# EAGLE design blinky_tag_tht_ver1 (EAGLE 9.5.2)
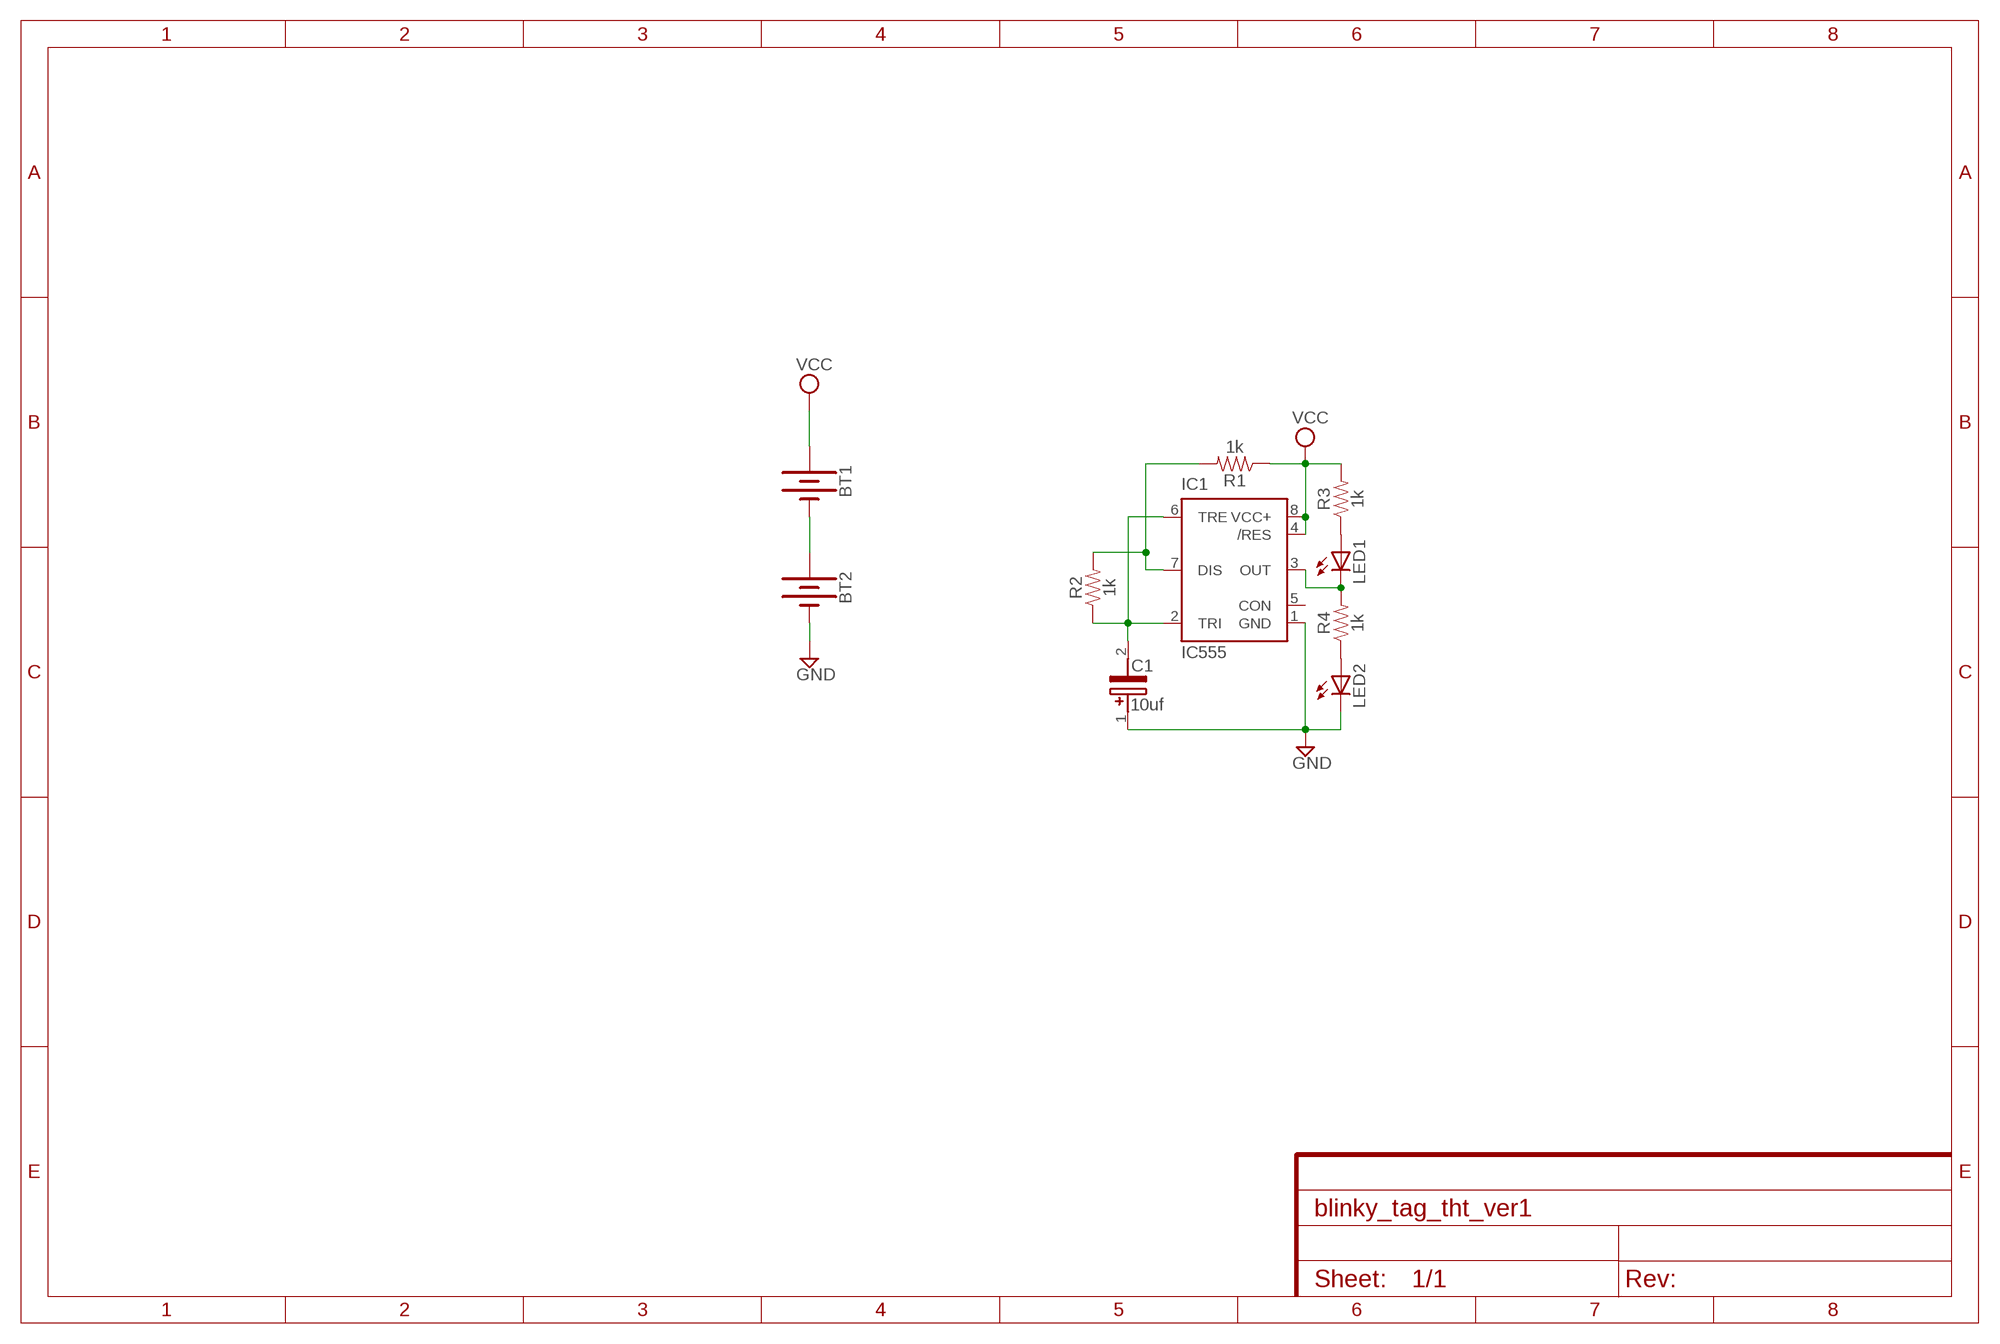
[diagram p0: schematic, sheet 1]

## Parts
BT1  BATTERY-12MM_SMD  [BATTCON_12MM]
BT2  BATTERY-12MM_SMD  [BATTCON_12MM]
C1  10uf  860020472003  [CAPPRD200W52D500H1250]
IC1  IC555  555KIT  [DIP08-KIT]
LED1  LED5MM  [LED5MM]
LED2  LED5MM  [LED5MM]
R1  1k  1KOHM-HORIZ-1/4W-5%  [AXIAL-0.3]
R2  1k  1KOHM-HORIZ-1/4W-5%  [AXIAL-0.3]
R3  1k  1KOHM-HORIZ-1/4W-5%  [AXIAL-0.3]
R4  1k  1KOHM-HORIZ-1/4W-5%  [AXIAL-0.3]

## Nets
GND: BT2.GND(-) C1.1(+) IC1.1(GND) LED2.K(C)
N$1: BT1.GND(-) BT2.PWR@1(+)
N$4: IC1.7(DIS) R1.P$2 R2.P$2
N$5: C1.2(-) IC1.2(TRI) IC1.6(TRE) R2.P$1
N$6: LED2.A R4.P$1
N$7: LED1.A R3.P$1
N$8: IC1.3(OUT) LED1.K(C) R4.P$2
VCC: BT1.PWR@1(+) IC1.4(/RES) IC1.8(VCC+) R1.P$1 R3.P$2
Unconnected: IC1.5(CON)

## Library data of the parts
BT1 BT2 = SparkFun-Batteries:BATTERY: Battery - Single Cell A variety of battery chemistries, sizes, and footprints. Device List: 20MM_PTH - Coin Cell Battery Holder - 20mm (PTH) <https://www.sparkfun.com/products/783> 6.8MM_PTH - Coin Cell Battery Holder - 6.8MM(SMD) <https://www.digikey.com/product-detail/en/seiko-instruments/MS621FE-FL11E/728-1057-ND/1889208?WT.srch=1&gclid=CNOQ5a6LzdQCFZS2wAodXCkE0g> 12MM_SMD - Coin Cell Battery Holder - 12mm (SMD) <https://www.sparkfun.com/products/10592> 12MM_PTH - Coin Cell Battery Holder - 12mm (PTH) <https://www.sparkfun.com/products/7948> 20MM_SMD - 20mm Coin Cell Battery Holder (SMD) (2 legs) Used on the Big Time Watch Kit <https://www.sparkfun.com/products/11734> 20MM_SMD_4LEGS - Coin Cell Battery Holder - 20mm (SMD) <https://www.sparkfun.com/products/11892> 20MM_SMD_4LEGS_OVERPASTE - Coin Cell Battery Holder - 20mm (SMD) <https://www.sparkfun.com/products/11892> (Over-paste on the legs) 24.5MM_PTH - Coin Cell Battery Holder - 24.5mm (PTH) <https://www.sparkfun.com/products/8863> 9V - 9V Battery Holder - PC Mount Used on the SparkFun SparkPunk Sound Kit <https://www.sparkfun.com/products/11177> and SparkFun SparkPunk Sequencer Kit <https://www.sparkfun.com/products/12707> 18650 - Battery Holder - 18650 (PTH) <https://www.sparkfun.com/products/13113> AA - Battery Holder - 1xAA (PTH) <https://www.sparkfun.com/products/7949> AAA - Battery Holder - 1xAAA (PTH) <https://www.sparkfun.com/products/12718> AA_KIT - Battery Holder - 1xAA (PTH) <https://www.sparkfun.com/products/7949> Special kit package - pads only have exposed copper on one side of the board. AAA_KIT - Battery Holder - 1xAAA (PTH) <https://www.sparkfun.com/products/12718> Special kit package - pads only have exposed copper on one side of the board.; OC_FARNELL: unknown; PROD_ID: BATT-08044; SF_SKU: PRT-10592
C1 = SamacSys_Parts:860020472003: Wurth Elektronik 10uF 25 V dc Aluminium Electrolytic Capacitor, WCAP-ATG5 Series 2000h 5 (Dia.) x 11mm Source: Datasheet <https://katalog.we-online.com/pbs/datasheet/860020472003.pdf>; DESCRIPTION: Wurth Elektronik 10uF 25 V dc Aluminium Electrolytic Capacitor, WCAP-ATG5 Series 2000h 5 (Dia.) x 11mm; HEIGHT: 12.5mm; MANUFACTURER_NAME: Wurth Elektronik; MANUFACTURER_PART_NUMBER: 860020472003; MF: RUBYCON; MOUSER_PART_NUMBER: 710-860020472003; MOUSER_PRICE-STOCK: https://www.mouser.com/Search/Refine.aspx?Keyword=710-860020472003; MPN: 100YXF10MEFC6.3X11; OC_FARNELL: 1144640; RS_PART_NUMBER: 8396508P; RS_PRICE-STOCK: http://uk.rs-online.com/web/p/products/8396508P
IC1 = SparkFun-IC-Special-Function:555: General purpose bipolar Timer Datasheet <http://www.sparkfun.com/datasheets/Components/General/ne555.pdf> SparkFun Products SparkFun SparkPunk Sequencer Kit <https://www.sparkfun.com/products/12707> (KIT-12707) Storefront Component: 555 Timer <https://www.sparkfun.com/products/9273> (COM-09273) Two parts valid for production: VFP: IC-11930 (M7555 PTH) VFP: IC-09173 (555 PTH) - Preferred; MF: ON SEMICONDUCTOR; MPN: LM555CN; OC_FARNELL: 2454497; PROD_ID: IC-09173; PROD_ID_ALT: IC-11930; VALUE: 555
LED1 LED2 = adafruit:LED: LED OSRAM: - CHIPLED LG R971, LG N971, LY N971, LG Q971, LY Q971, LO R971, LY R971 LH N974, LH R974 LS Q976, LO Q976, LY Q976 LO Q996 - Hyper CHIPLED LW Q18S LB Q993, LB Q99A, LB R99A - SideLED LS A670, LO A670, LY A670, LG A670, LP A670 LB A673, LV A673, LT A673, LW A673 LH A674 LY A675 LS A676, LA A676, LO A676, LY A676, LW A676 LS A679, LY A679, LG A679 - Hyper Micro SIDELED® LS Y876, LA Y876, LO Y876, LY Y876 LT Y87S - SmartLED LW L88C, LW L88S LB L89C, LB L89S, LG L890 LS L89K, LO L89K, LY L89K LS L896, LA L896, LO L896, LY L896 - TOPLED LS T670, LO T670, LY T670, LG T670, LP T670 LSG T670, LSP T670, LSY T670, LOP T670, LYG T670 LG T671, LOG T671, LSG T671 LB T673, LV T673, LT T673, LW T673 LH T674 LS T676, LA T676, LO T676, LY T676, LB T676, LH T676, LSB T676, LW T676 LB T67C, LV T67C, LT T67C, LS T67K, LO T67K, LY T67K, LW E67C LS E67B, LA E67B, LO E67B, LY E67B, LB E67C, LV E67C, LT E67C LW T67C LS T679, LY T679, LG T679 LS T770, LO T770, LY T770, LG T770, LP T770 LB T773, LV T773, LT T773, LW T773 LH T774 LS E675, LA E675, LY E675, LS T675 LS T776, LA T776, LO T776, LY T776, LB T776 LHGB T686 LT T68C, LB T68C - Hyper Mini TOPLED® LB M676 - Mini TOPLED Santana® LG M470 LS M47K, LO M47K, LY M47K Source: http://www.osram.convergy.de/; OC_FARNELL: unknown
R1-R4 = SparkFun-Resistors:1KOHM: 1kΩ resistor A resistor is a passive two-terminal electrical component that implements electrical resistance as a circuit element. Resistors act to reduce current flow, and, at the same time, act to lower voltage levels within circuits. - Wikipedia; OC_FARNELL: unknown; PROD_ID: RES-08380

## Board
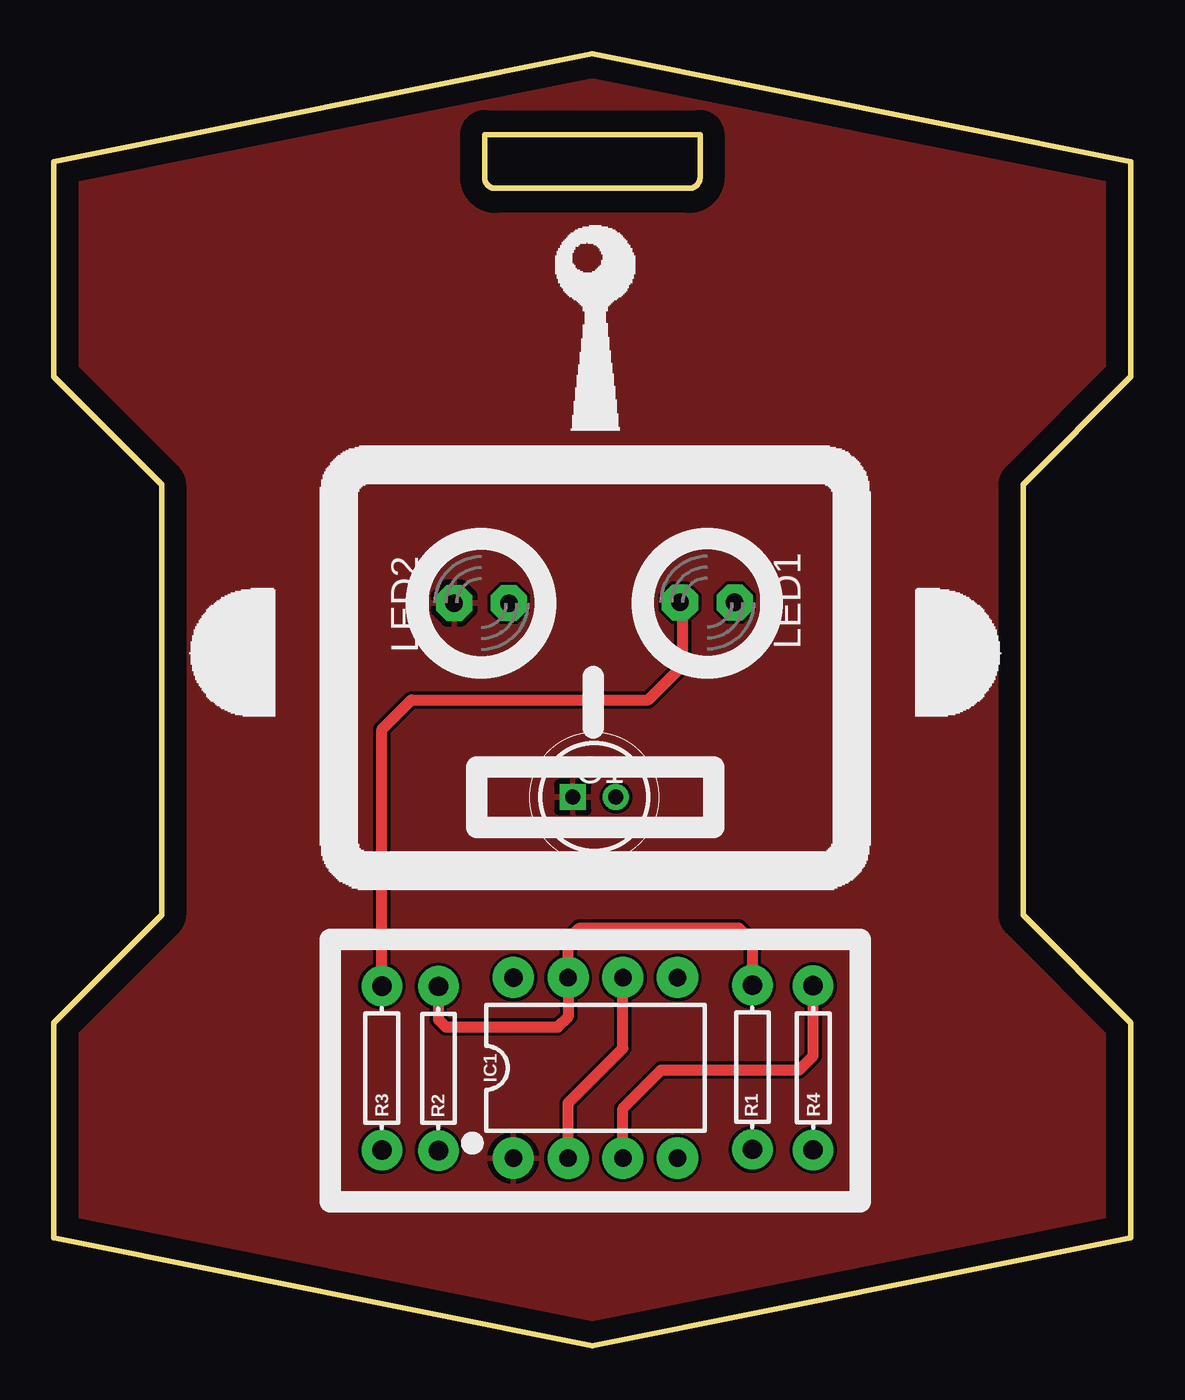
[diagram p1: board, top side]
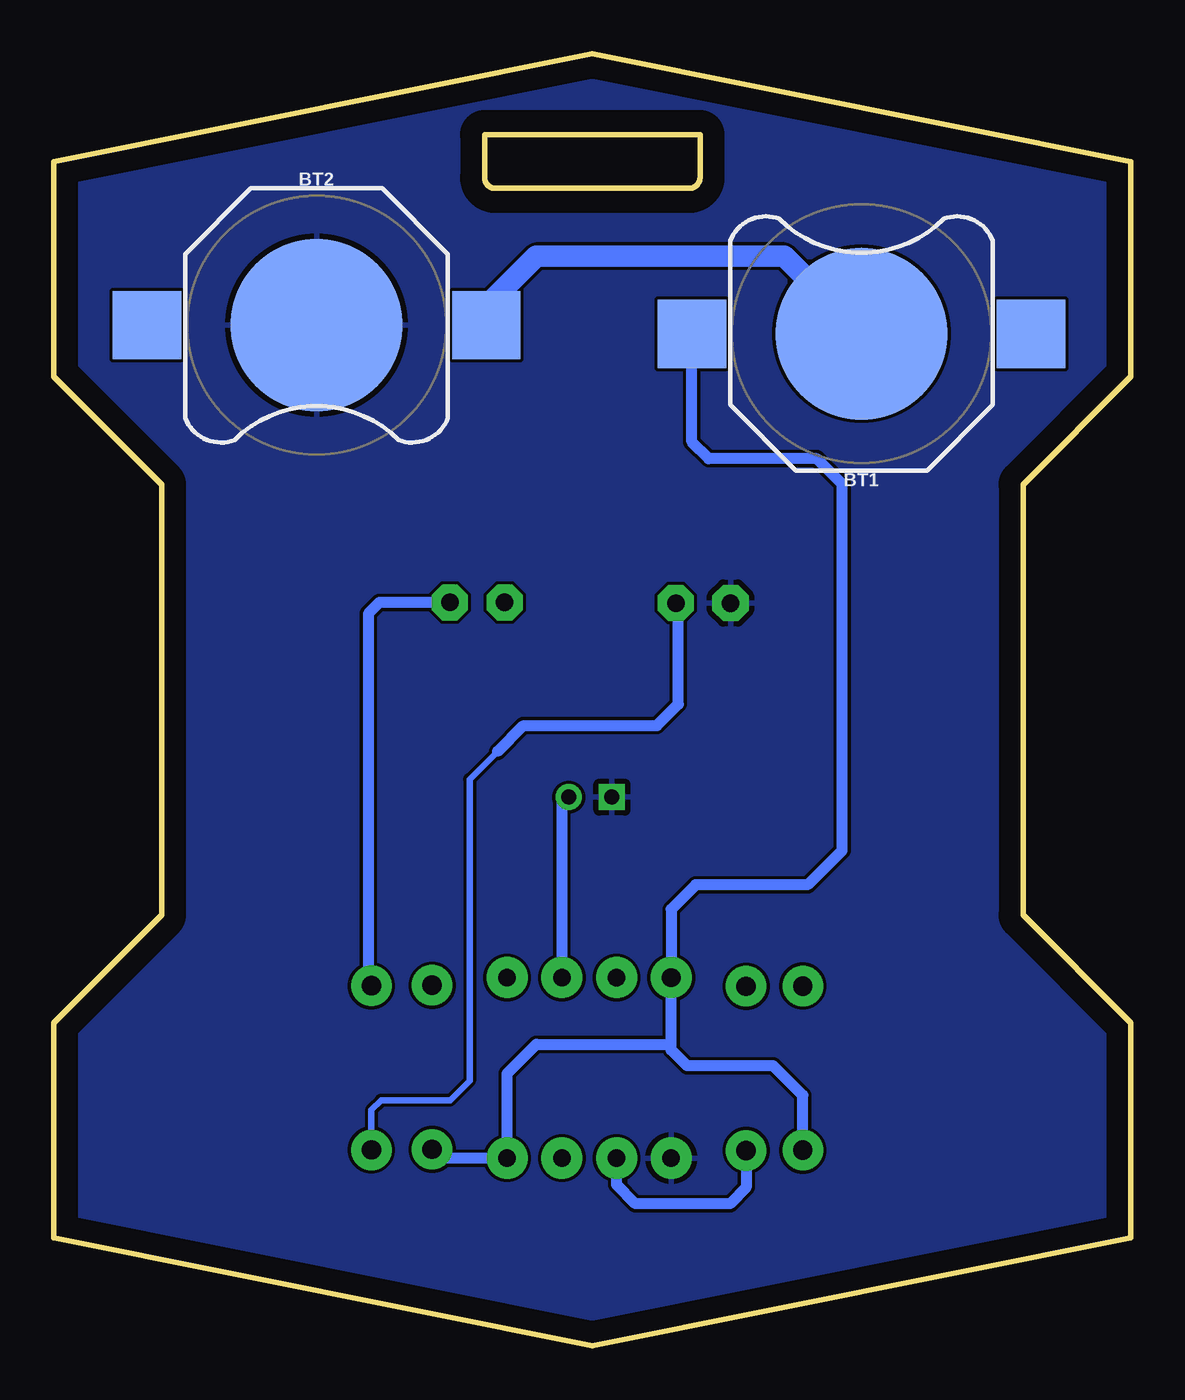
[diagram p2: board, bottom side, seen from below]

Size 50 x 60 mm. Coordinates in mm from the lower left corner, seen from the top.
Outline: 45,20 45,40 50,45 50,55 25,60 0,55 0,45 5,40 5,20 0,15 0,5 25,0 50,5 50,15 45,20
Outline: 20.5,53.75 arc-90 20,54.25 20,56.25 30,56.25 30,54.25 arc-90 29.5,53.75 20.5,53.75
Copper layers (1*16): Top 0.035mm / dielectric 1.5mm / Bottom 0.035mm
Design rules "default": minimum track width 6mil, minimum drill 0.35mm, track to track 6mil, track to pad 6mil, pad to pad 6mil, via to via 6mil, smd to smd 6mil, copper to edge 40mil, drill to drill 6mil, minimum pad ring 10mil, minimum via ring 8mil, stop-mask expansion 4mil, vias tented up to drill 0mil, thermal gap 10mil

### Footprints (pad centres in the part's own frame; a part is rotated, then mirrored left to right if it is on the bottom)
BATTCON_12MM = smd 8 x 8: GND 0,0 | smd 3.175 x 3.175: PWR@1 -7.874,0; PWR@2 7.874,0
CAPPRD200W52D500H1250 = drill 0.7 pad 1.1 square: 1 0,0 | drill 0.7 pad 1.1: 2 2,0
DIP08-KIT = drill 0.813 pad 1.905: 1 -3.81,-4.191; 2 -1.27,-4.191; 3 1.27,-4.191; 4 3.81,-4.191; 5 3.81,4.191; 6 1.27,4.191; 7 -1.27,4.191 | drill 0.864 pad 1.905: 8 -3.81,4.191
LED5MM = drill 0.813 pad 1.676 octagon: A -1.27,0; K 1.27,0
AXIAL-0.3 = drill 0.9 pad 1.88: P$1 -3.81,0; P$2 3.81,0

### Placement (x,y rotation side)
BT1  12.5,47 0 bottom
BT2  37.8,47.4 180 bottom
C1  24.09,25.48 0 top
IC1  25.15,12.9 0 top
LED1  30.34,34.52 0 top
LED2  19.85,34.49 180 top
R1  32.44,12.93 90 top
R2  17.86,12.88 90 top
R3  15.23,12.89 270 top
R4  35.26,12.9 90 top
U$1  [ROBOT_2.8X_B]  11.04,4.88 0 top

### Tracks (layer width: path | path; a pad name or v marks a point on that pad's centre or on a via)
GND
  pour Top: 0,15 0,5 25,0 50,5 50,15 45,20 45,40 50,45 50,55 25,60 0,55 0,45 5,40 5,20
  pour Bottom: 25,0 0,5 0,15 5,20 5,40 0,45 0,55 25,60 50,55 50,45 45,40 45,20 50,15 50,5
N$1
  Bottom 1: BT1.GND 16.1,50.6 27.6,50.6 29.93,48.27 BT2.PWR@1
N$4
  Top 0.5: R2.P$2 17.86,15.14 18.2,14.8 23.4,14.8 23.9,15.3 23.9,17.07 IC1.7 23.88,18.88 24.4,19.4 31.8,19.4 32.44,18.76 R1.P$2
N$5
  Top 0.5: IC1.2 23.88,11.28 26.42,13.82 IC1.6
  Bottom 0.5: R2.P$1 17.86,7.34 18.6,6.6 23,6.6 23.88,7.48 IC1.2 | C1.2 26.42,25.15 IC1.6
N$6
  Bottom 0.3: 29.4,27.6 30.7,26.3 30.7,12.3 31.6,11.4 34.8,11.4 35.26,10.95 R4.P$1
  Bottom 0.5: 29.4,27.6 28.2,28.8 22,28.8 21,29.8 21,34.37 LED2.A
N$7
  Top 0.5: R3.P$1 15.23,28.63 16.6,30 27.6,30 29.2,31.6 29.2,34.39 LED1.A
N$8
  Top 0.5: IC1.3 26.42,11.02 28.2,12.8 34.6,12.8 35.26,13.46 R4.P$2
  Bottom 0.5: LED1.K 34.88,34.52 35.4,34 35.4,16.86 R4.P$2
VCC
  Bottom 0.5: BT1.PWR@1 20.37,41.97 19.6,41.2 14.57,41.2 13.4,40.03 13.4,23 15,21.4 20.2,21.4 21.34,20.26 IC1.8 21.34,14 | R3.P$2 15.23,11.63 16.6,13 20.6,13 21.34,13.74 21.34,14 | 21.34,14 27.6,14 28.96,12.64 IC1.4 32.03,8.71 R1.P$1